# Altium schematic sheet CodeBlock.SchDoc
size 594 x 420 mm; ЕСКД_Децимальний_номер: ДК51.425332.001; ЕСКД_Розробив: Федоренко С.Д.; ЕСКД_Перевірив: Адаменко І.О.; ЕСКД_Затвердив: Губар В.Г.; ЕСКД_Організація_1: КПІ ім. Ігоря Сікорського; PageSetup: Record=PageOptions|CenterHorizontal=True|CenterVertical=True|PrintScale=0.98|XCorrection=1.00|YCorrection=1.00|PrintKind=1|BorderSize=5000000|LeftOffset=0|BottomOffset=0|Orientation=2|PaperLength=1000|PaperWidth=1000|Scale=100|PaperSource=15|PrintQuality=1200|MediaType=1|DitherType=10|PrintScaleMode=1|PaperKind=A3|PaperIndex=8; ЕСКД_Організація_2: ФЕЛ, КЕОА; ЕСКД_Назва_схеми: Схема електрична принципова; ЕСКД_Маштаб: 1:1; ЕСКД_Тема: система.; ЕСКД_Тема_1: Багатоканальна охоронна; ЕСКД_Тема_повна: Багатоканальна охоронна система; ЕСКД_Децимальний_номер_Е3: ДК51.425332.001Е3; Rule: PcbType=ProtelPcb
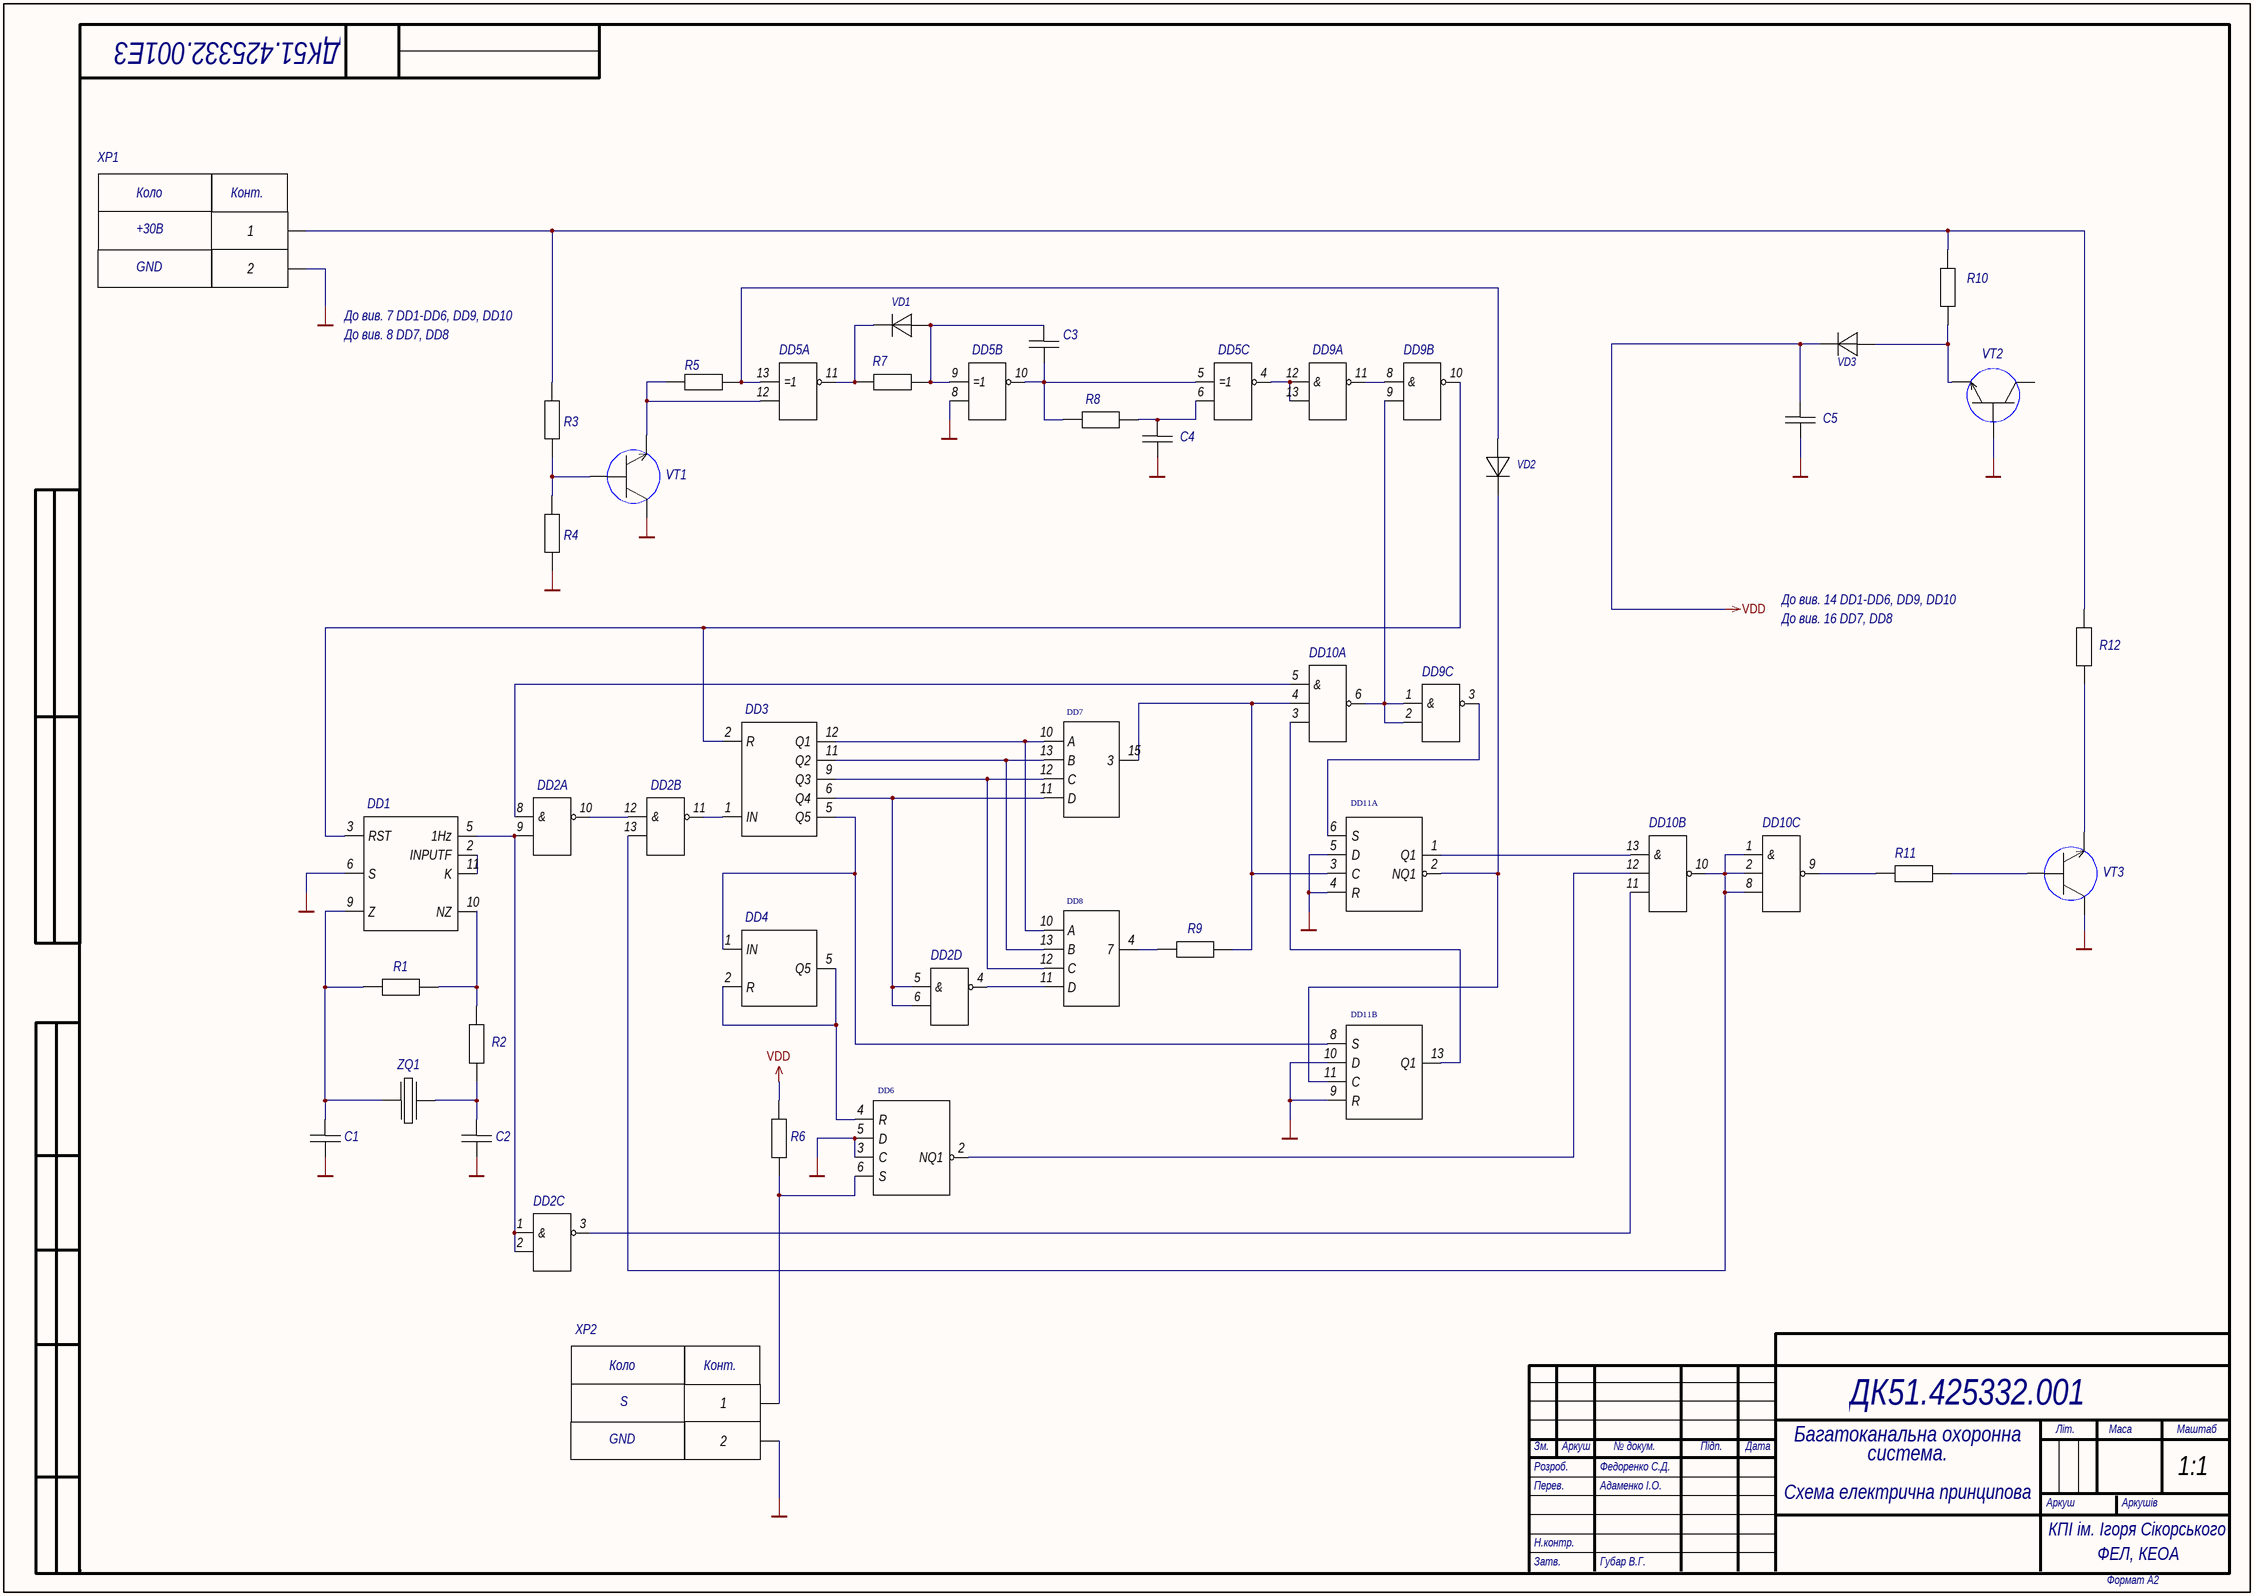
[diagram p0: CodeBlock.SchDoc]

## Parts
C1  С-0805 50 В 62 пФ 5% C0G/NP0 Kemet  [C-0805]  (value not drawn)
C2  С-0805 50 В 22 пФ 5% C0G/NP0 Kemet  [C-0805]  (value not drawn)
C3  С-0805 50 В 0.1 пФ 5% C0G/NP0 Kemet  [C-0805]  (value not drawn)
C4  С-0805 50 В 3300 пФ 5% C0G/NP0 Kemet  [C-0805]  (value not drawn)
C5  С-0805 50 В 100 пФ 5% C0G/NP0 Kemet  [C-0805]  (value not drawn)
DD1  К176ИЕ5 СССР  [DIP14]  (value not drawn)
DD2  SN74F38DR Texas Instruments  [D14]  (value not drawn)  (parts A,B,C,D of 4)
DD3  SN74F24DR Texas Instruments  [D14]  (value not drawn)
DD4  SN74F24DR Texas Instruments  [D14]  (value not drawn)
DD5  SN74F86DR Texas Instruments  [D14]  (value not drawn)  (parts A,B,C of 3)
DD6  SN74F13DR Texas Instruments  [D14]  (value not drawn)
DD7  SN74F28DR Texas Instruments  [D16]  (value not drawn)
DD8  SN74F28DR Texas Instruments  [D16]  (value not drawn)
DD9  SN74F38DR Texas Instruments  [D14]  (value not drawn)  (parts A,B,C of 3)
DD10  SN74F10DR Texas Instruments  [D14]  (value not drawn)  (parts A,B,C of 3)
DD11  SN74F13DR Texas Instruments  [D14]  (value not drawn)  (parts A,B of 2)
R1  R-0805 0,125 Вт 22 МОм 5% Hitano  [RC0805N]  (value not drawn)
R2  R-0805 0,125 Вт 560 кОм 5% Hitano  [RC0805N]  (value not drawn)
R3  R-0805 0,125 Вт 100 кОм 5% Hitano  [RC0805N]  (value not drawn)
R4  R-0805 0,125 Вт 10 кОм 5% Hitano  [RC0805N]  (value not drawn)
R5  R-0805 0,125 Вт 56 кОм 5% Hitano  [RC0805N]  (value not drawn)
R6  R-0805 0,125 Вт 1 кОм 5% Hitano  [RC0805N]  (value not drawn)
R7  R-0805 0,125 Вт 200 кОм 5% Hitano  [RC0805N]  (value not drawn)
R8  R-0805 0,125 Вт 10 кОм 5% Hitano  [RC0805N]  (value not drawn)
R9  R-0805 0,125 Вт 56 кОм 5% Hitano  [RC0805N]  (value not drawn)
R10  R-0805 0,125 Вт 10 кОм 5% Hitano  [RC0805N]  (value not drawn)
R11  R-0805 0,125 Вт 1.8 кОм 5% Hitano  [RC0805N]  (value not drawn)
R12  R-0805 0,125 Вт 100 Ом 5% Hitano  [RC0805N]  (value not drawn)
VD1  1N4148W-7-F NXP  [SOD123]  (value not drawn)
VD2  1N4148W-7-F NXP  [SOD123]  (value not drawn)
VD3  1N4148W-7-F NXP  [SOD123]  (value not drawn)
VT1  PBSS2540E ON Semiconductor  [SOT23]  (value not drawn)
VT2  PBSS2540E ON Semiconductor  [SOT23]  (value not drawn)
VT3  PBSS2540E ON Semiconductor  [SOT23]  (value not drawn)
XP1  732-2747-ND KLS  [TE 282834-2]  (value not drawn)
XP2  PLS-2 Ningbo Zhenqin Electronic  [PLS-2]  (value not drawn)
ZQ1  ABMM2-32.768MHZ Jauch  [CRYSTAL_ABMM2]  (value not drawn)

## Nets
GND: C1.1 C2.1 C4.1 C5.1 DD1.6(S) DD1.7(GND) DD2.7(GND) DD3.7(GND) DD4.7(GND) DD5.7(GND) DD5.8 DD6.3(C) DD6.5(D) DD6.7(GND) DD7.8(GND) DD8.8(GND) DD9.7(GND) DD10.7(GND) DD11.4(R) DD11.5(D) DD11.7(GND) DD11.9(R) DD11.10(D) R4.1 VT1.3 VT2.1 VT3.3 XP1.2 XP2.2
VDD: C5.2 DD1.14(VDD) DD2.14(VDD) DD3.14(VDD) DD4.14(VDD) DD5.14(VDD) DD6.14(VDD) DD7.16(VDD) DD8.16(VDD) DD9.14(VDD) DD10.14(VDD) DD11.14(VDD) R6.2 VD3.2
NetC1_2: C1.2 DD1.9(Z) R1.1 ZQ1.1
NetC2_2: C2.2 R2.1 ZQ1.3
NetC3_1: C3.1 DD5.5(=1) DD5.10 R8.1
NetC3_2: C3.2 DD5.9(=1) R7.2 VD1.1
NetC4_2: C4.2 DD5.6 R8.2
NetDD1_2: DD1.2(INPUTF) DD1.11(K)
NetDD1_3: DD1.3(RST) DD3.2(R) DD9.10
NetDD1_5: DD1.5(1Hz) DD2.1(&) DD2.2 DD2.9
NetDD1_10: DD1.10(NZ) R1.2 R2.2
NetDD2_3: DD2.3 DD10.11
NetDD2_4: DD2.4 DD8.11(D)
NetDD2_5: DD2.5(&) DD2.6 DD3.6(Q4) DD7.11(D)
NetDD2_8: DD2.8(&) DD10.5(&)
NetDD2_10: DD2.10 DD2.12(&)
NetDD2_11: DD2.11 DD3.1(IN)
NetDD2_13: DD2.13 DD10.1(&) DD10.2 DD10.8 DD10.10
NetDD3_5: DD3.5(Q5) DD4.1(IN) DD11.8(S)
NetDD3_9: DD3.9(Q3) DD7.12(C) DD8.12(C)
NetDD3_11: DD3.11(Q2) DD7.13(B) DD8.13(B)
NetDD3_12: DD3.12(Q1) DD7.10(A) DD8.10(A)
NetDD4_2: DD4.2(R) DD4.5(Q5) DD6.4(R)
NetDD5_4: DD5.4 DD9.12(&) DD9.13
NetDD5_11: DD5.11 R7.1 VD1.2
NetDD5_12: DD5.12 R5.2 VT1.2
NetDD5_13: DD5.13(=1) R5.1 VD2.1
NetDD6_2: DD6.2(NQ1) DD10.12
NetDD6_6: DD6.6(S) R6.1 XP2.1
NetDD7_15: DD7.15(3) DD10.4 DD11.3(C) R9.2
NetDD8_4: DD8.4(7) R9.1
NetDD9_1: DD9.1(&) DD9.2 DD9.9 DD10.6
NetDD9_3: DD9.3 DD11.6(S)
NetDD9_8: DD9.8(&) DD9.11
NetDD10_3: DD10.3 DD11.13(Q1)
NetDD10_9: DD10.9 R11.1
NetDD10_13: DD10.13(&) DD11.1(Q1)
NetDD11_2: DD11.2(NQ1) DD11.11(C) VD2.2
NetR3_1: R3.1 R4.2 VT1.1
NetR3_2: R3.2 R10.2 R12.2 XP1.1
NetR10_1: R10.1 VD3.1 VT2.2
NetR11_2: R11.2 VT3.1
NetR12_1: R12.1 VT3.2

Not connected (* = marked no-connect by the designer): VT2 3

## Notes on the sheet
- +30B
- GND
- До вив. 7 DD1-DD6, DD9, DD10
- До вив. 8 DD7, DD8
- До вив. 14 DD1-DD6, DD9, DD10
- До вив. 16 DD7, DD8
- S
- Зм.
- Аркуш
- № докум.
- Підп.
- Дата
- Літ.
- Маса
- Маштаб
- Розроб.
- Перев.
- Аркушів
- Н.контр.
- Затв.
- Формат А2
- (in symbol 732-2747-ND(Input)) Коло; Конт.
- (in symbol PLS-2) Коло; Конт.

## Library data of the parts
C1 = C-0805: Value: 62 пФ; Voltage: 50 В; Package: С-0805; Temp_Coef: C0G/NP0; Tolerance: 5%; Manufacturer: Kemet
C2 = C-0805: Value: 22 пФ; Voltage: 50 В; Package: С-0805; Temp_Coef: C0G/NP0; Tolerance: 5%; Manufacturer: Kemet
C3 = C-0805: Value: 0.1 пФ; Voltage: 50 В; Package: С-0805; Temp_Coef: C0G/NP0; Tolerance: 5%; Manufacturer: Kemet
C4 = C-0805: Value: 3300 пФ; Voltage: 50 В; Package: С-0805; Temp_Coef: C0G/NP0; Tolerance: 5%; Manufacturer: Kemet
C5 = C-0805: Value: 100 пФ; Voltage: 50 В; Package: С-0805; Temp_Coef: C0G/NP0; Tolerance: 5%; Manufacturer: Kemet
DD1 = K176IE5(DD1): CD4033BNSR; Manufacturer: СССР; ComponentLink1Description: Component; ComponentLink1URL: https://www.digikey.com/product-detail/en/texas-instruments/CD4033BNSR/CD4033BNSR-ND/1690980; Name: К176ИЕ5
DD2 = K561LA7(DD2): CD4011BM96; Name: SN74F38DR; Manufacturer: Texas Instruments; ComponentLink1Description: CD4011BM96; ComponentLink1URL: https://www.digikey.com/product-detail/en/texas-instruments/CD4011BM96/296-14474-2-ND/555772; ComponentLink2Description: Component; ComponentLink2URL: https://www.digikey.com/product-detail/en/texas-instruments/SN74F38DR/296-14312-2-ND/528568
DD3 = K176IE1(DD3): CD4024BM; Manufacturer: Texas Instruments; Name: SN74F24DR; ComponentLink1Description: Component; ComponentLink1URL: https://www.digikey.com/product-detail/en/texas-instruments/CD4024BM/296-25942-5-ND/1690888
DD4 = K176IE1(DD11): CD4024BM; Manufacturer: Texas Instruments; Name: SN74F24DR; ComponentLink1Description: Component; ComponentLink1URL: https://www.digikey.com/product-detail/en/texas-instruments/CD4024BM/296-25942-5-ND/1690888
DD5 = K561LP2(DD9): CD4070BM96; ComponentLink1Description: Component; ComponentLink1URL: https://www.digikey.com/product-detail/en/texas-instruments/CD4070BM96/296-31517-2-ND/1691299; Name: SN74F86DR; Manufacturer: Texas Instruments
DD6 = K561TM2(DD8): CD4013BM96; Manufacturer: Texas Instruments; Name: SN74F13DR; ComponentLink1Description: Component; ComponentLink1URL: https://www.digikey.com/product-detail/en/texas-instruments/CD4013BM96/296-24347-2-ND/1690718
DD7 = K561ID1(DD4): CD4028BM96; Manufacturer: Texas Instruments; Name: SN74F28DR; ComponentLink1Description: Component; ComponentLink1URL: https://www.digikey.com/product-detail/en/texas-instruments/CD4028BM96/296-16702-2-ND/614903
DD8 = K561ID1(DD5): CD4028BM96; Manufacturer: Texas Instruments; Name: SN74F28DR; ComponentLink1Description: Component; ComponentLink1URL: https://www.digikey.com/product-detail/en/texas-instruments/CD4028BM96/296-16702-2-ND/614903
DD9 = K561LA7(DD10): CD4011BM96; ComponentLink1Description: Component; ComponentLink1URL: https://www.digikey.com/product-detail/en/texas-instruments/CD4011BM96/296-14474-2-ND/555772; Name: SN74F38DR; Manufacturer: Texas Instruments
DD10 = K561LA9(DD7): CD4023BM; ComponentLink1Description: Component; ComponentLink1URL: https://www.digikey.com/product-detail/en/texas-instruments/CD4023BM/296-25941-5-ND/1690876; Name: SN74F10DR; Manufacturer: Texas Instruments
DD11 = K561TM2(DD6): CD4013BM96; Manufacturer: Texas Instruments; Name: SN74F13DR; ComponentLink1Description: Component; ComponentLink1URL: https://www.digikey.com/product-detail/en/texas-instruments/CD4013BM96/296-24347-2-ND/1690718
R1 = R-0805: Value: 22 МОм; Package: R-0805; Power: 0,125 Вт; Tolerance: 5%; Manufacturer: Hitano; ComponentLink1Description: Component; ComponentLink1URL: https://www.digikey.com/product-detail/en/yageo/RC0805JR-07100RL/311-100ARTR-ND/728238
R2 = R-0805: Value: 560 кОм; Package: R-0805; Power: 0,125 Вт; Tolerance: 5%; Manufacturer: Hitano; ComponentLink1Description: Component; ComponentLink1URL: https://www.digikey.com/product-detail/en/yageo/RC0805JR-07100RL/311-100ARTR-ND/728238
R3 = R-0805: Value: 100 кОм; Package: R-0805; Power: 0,125 Вт; Tolerance: 5%; Manufacturer: Hitano; ComponentLink1Description: Component; ComponentLink1URL: https://www.digikey.com/product-detail/en/yageo/RC0805JR-07100RL/311-100ARTR-ND/728238
R4 R8 R10 = R-0805: Value: 10 кОм; Package: R-0805; Power: 0,125 Вт; Tolerance: 5%; Manufacturer: Hitano; ComponentLink1Description: Component; ComponentLink1URL: https://www.digikey.com/product-detail/en/yageo/RC0805JR-07100RL/311-100ARTR-ND/728238
R5 R9 = R-0805: Value: 56 кОм; Package: R-0805; Power: 0,125 Вт; Tolerance: 5%; Manufacturer: Hitano; ComponentLink1Description: Component; ComponentLink1URL: https://www.digikey.com/product-detail/en/yageo/RC0805JR-07100RL/311-100ARTR-ND/728238
R6 = R-0805: Value: 1 кОм; Package: R-0805; Power: 0,125 Вт; Tolerance: 5%; Manufacturer: Hitano; ComponentLink1Description: Component; ComponentLink1URL: https://www.digikey.com/product-detail/en/yageo/RC0805JR-07100RL/311-100ARTR-ND/728238
R7 = R-0805: Value: 200 кОм; Package: R-0805; Power: 0,125 Вт; Tolerance: 5%; Manufacturer: Hitano; ComponentLink1Description: Component; ComponentLink1URL: https://www.digikey.com/product-detail/en/yageo/RC0805JR-07100RL/311-100ARTR-ND/728238
R11 = R-0805: Value: 1.8 кОм; Package: R-0805; Power: 0,125 Вт; Tolerance: 5%; Manufacturer: Hitano; ComponentLink1Description: Component; ComponentLink1URL: https://www.digikey.com/product-detail/en/yageo/RC0805JR-07100RL/311-100ARTR-ND/728238
R12 = R-0805: Value: 100 Ом; Package: R-0805; Power: 0,125 Вт; Tolerance: 5%; Manufacturer: Hitano; ComponentLink1Description: Component; ComponentLink1URL: https://www.digikey.com/product-detail/en/yageo/RC0805JR-07100RL/311-100ARTR-ND/728238
VD1-VD3 = 1N4148W-7-F: Manufacturer: NXP; Name: 1N4148W-7-F
VT1-VT3 = KSC1623YMTF: Manufacturer: ON Semiconductor; Name: PBSS2540E; ComponentLink1Description: Component; ComponentLink1URL: https://www.digikey.com/product-detail/en/on-semiconductor/KSC1623YMTF/KSC1623YMTFTR-ND/1047566
XP1 = 732-2747-ND(Input): 732-2747-ND; Manufacturer: KLS; Name: 732-2747-ND
XP2 = PLS-2: Manufacturer: Ningbo Zhenqin Electronic; Name: PLS-2
ZQ1 = ABMM2-32.768kHZ: Manufacturer: Jauch; Name: ABMM2-32.768MHZ